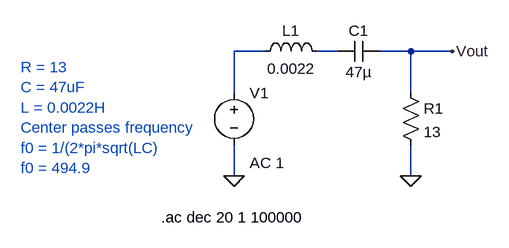
[diagram p0: schematic Band Pass Filter.asc]
Band Pass Filter.asc, the LTspice schematic file:
Version 4.1
SHEET 1 880 680
WIRE 224 32 176 32
WIRE 336 32 304 32
WIRE 448 32 400 32
WIRE 512 32 448 32
WIRE 176 96 176 32
WIRE 448 96 448 32
WIRE 176 224 176 176
WIRE 448 224 448 176
FLAG 176 224 0
FLAG 448 224 0
FLAG 512 32 Vout
SYMBOL voltage 176 80 R0
WINDOW 123 24 124 Left 2
WINDOW 39 0 0 Left 0
SYMATTR InstName V1
SYMATTR Value ""
SYMATTR Value2 AC 1
SYMBOL ind 208 48 R270
WINDOW 0 32 56 VTop 2
WINDOW 3 5 56 VBottom 2
SYMATTR InstName L1
SYMATTR Value 0.0022
SYMBOL cap 400 16 R90
WINDOW 0 0 32 VBottom 2
WINDOW 3 32 32 VTop 2
SYMATTR InstName C1
SYMATTR Value 47µ
SYMBOL res 432 80 R0
SYMATTR InstName R1
SYMATTR Value 13
TEXT -152 56 Left 2 ;R = 13\nC = 47uF\nL = 0.0022H\nCenter passes frequency\nf0 = 1/(2*pi*sqrt(LC)\nf0 = 494.9
TEXT 64 288 Left 2 !.ac dec 20 1 100000

The netlist it stands for:
* Band Pass Filter.asc
V1 N001 0 AC 1
L1 N001 N002 0.0022
C1 Vout N002 47µ
R1 Vout 0 13
* R = 13
* C = 47uF
* L = 0.0022H
* Center passes frequency
* f0 = 1/(2*pi*sqrt(LC)
* f0 = 494.9
.ac dec 20 1 100000
.backanno
.end